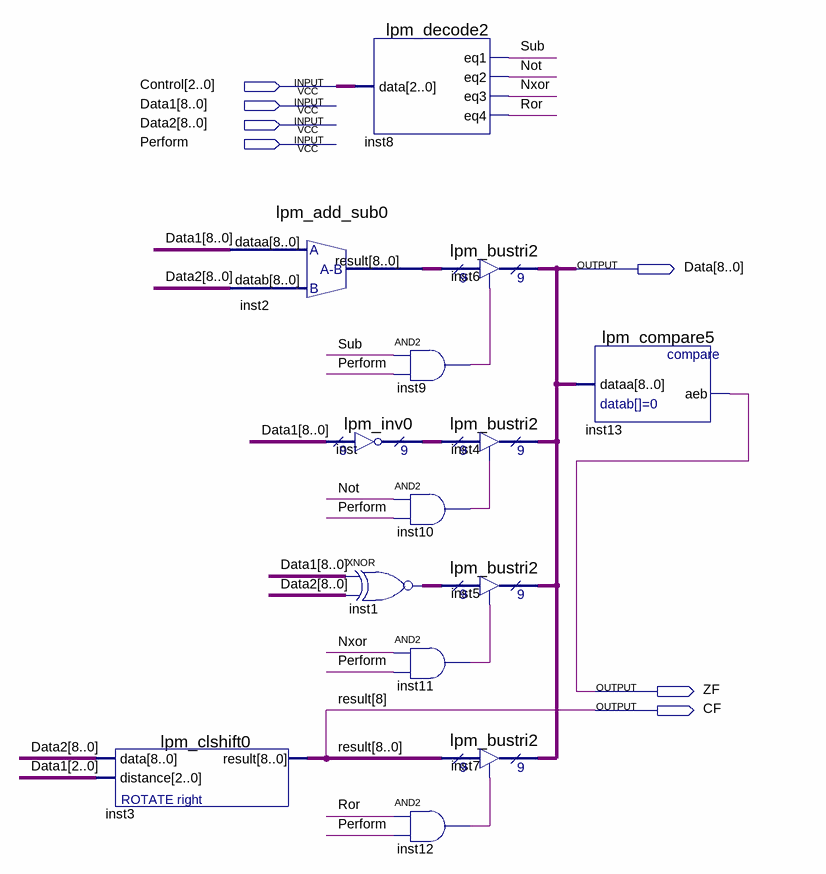
[diagram p0: schematic sheet]
// Quartus schematic AluBlock.bdf as structural Verilog: 14 symbols, 7 pins
module AluBlock (
  input  [2:0] Control,
  input  [8:0] Data1,
  input  [8:0] Data2,
  input  Perform,
  output [8:0] Data,
  output ZF,
  output CF
);

  wire inst9_out, inst10_out, inst11_out, inst12_out, Not, Nxor, Ror, Sub;
  wire [7:0] result;
  wire [8:0] inst1_out, inst2_result, inst_result;

  lpm_clshift0 inst3 (.data(Data2), .distance(Data1[2:0]), .result({CF, result}));
  lpm_add_sub0 inst2 (.dataa(Data1), .datab(Data2), .result(inst2_result));
  lpm_decode2 inst8 (.data(Control), .eq1(Sub), .eq2(Not), .eq3(Nxor), .eq4(Ror));
  and inst9 (inst9_out, Sub, Perform);
  lpm_inv0 inst (.data(Data1), .result(inst_result));
  and inst10 (inst10_out, Not, Perform);
  assign inst1_out = ~(Data1 ^ Data2);  // XNOR inst1, 9 bits wide
  and inst11 (inst11_out, Nxor, Perform);
  and inst12 (inst12_out, Ror, Perform);
  lpm_bustri2 inst6 (.enabledt(inst9_out), .data(inst2_result), .tridata(Data));
  lpm_bustri2 inst4 (.enabledt(inst10_out), .data(inst_result), .tridata(Data));
  lpm_bustri2 inst5 (.enabledt(inst11_out), .data(inst1_out), .tridata(Data));
  lpm_bustri2 inst7 (.enabledt(inst12_out), .data({CF, result}), .tridata(Data));
  lpm_compare5 inst13 (.dataa(Data), .aeb(ZF));

  // Other names for the same wires on the sheet: result[8] = CF
endmodule
